# Altium schematic sheet Misc.SchDoc
size A4
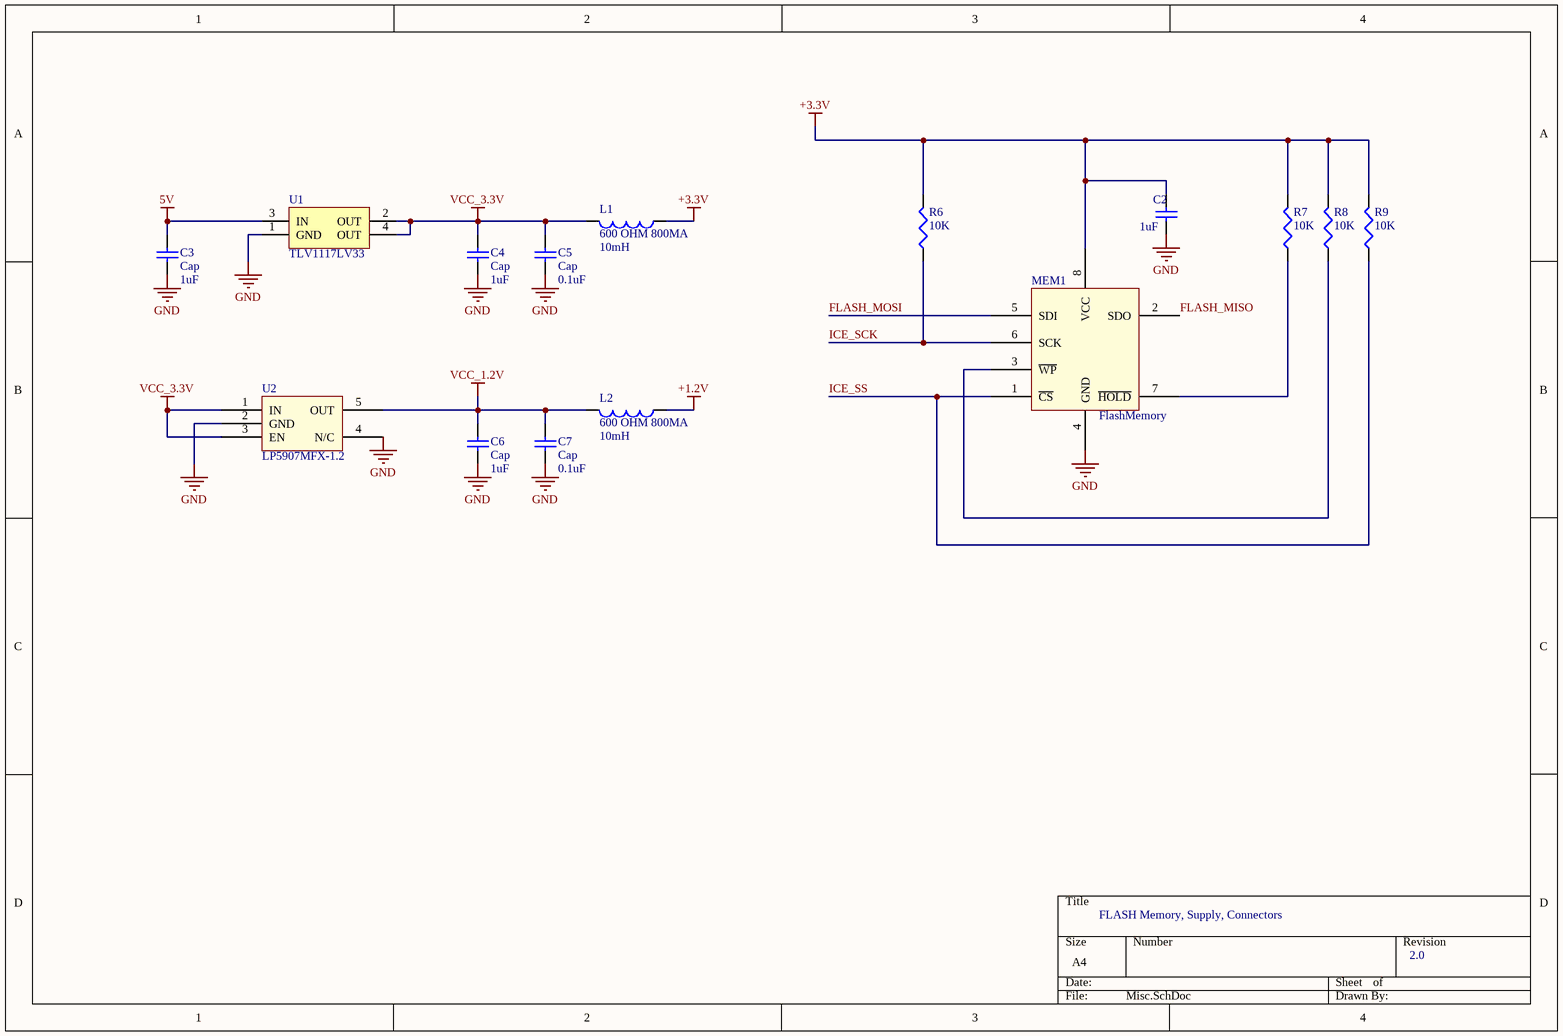
[diagram p0: Misc.SchDoc]

## Parts
C2  value 1uF  [C0402]  (hidden comment: Cap Semi)
C3  Cap  value 1uF  [C0603]
C4  Cap  value 1uF  [C0603]
C5  Cap  value 0.1uF  [C0402]
C6  Cap  value 1uF  [C0402]
C7  Cap  value 0.1uF  [C0402]
L1  600 OHM 800MA  value 10mH  [J1-0603]
L2  600 OHM 800MA  value 10mH  [J1-0603]
MEM1  FlashMemory  [SOP8FlashCorrect]
R6  value 10K  [R0402]  (hidden comment: Res3)
R7  value 10K  [R0402]  (hidden comment: Res3)
R8  value 10K  [R0402]  (hidden comment: Res3)
R9  value 10K  [R0402]  (hidden comment: Res3)
U1  TLV1117LV33  [ZZ311]
U2  LP5907MFX-1.2  [1-2Regulator]

## Nets
5V: C3.2 U1.3(IN)
+1.2V: L2.1
+3.3V: C2.2 L1.1 MEM1.8(VCC) R6.2 R7.2 R8.2 R9.2
GND: C2.1 C3.1 C4.1 C5.1 C6.1 C7.1 MEM1.4(GND) U1.1(GND) U2.2(GND) U2.4(N/C)
VCC_1.2V: C6.2 C7.2 L2.2 U2.5(OUT)
VCC_3.3V: C4.2 C5.2 L1.2 U1.2(OUT) U1.4(OUT) U2.1(IN) U2.3(EN)
FLASH_MISO: MEM1.2(SDO)
FLASH_MOSI: MEM1.5(SDI)
ICE_SCK: MEM1.6(SCK) R6.1
ICE_SS: MEM1.1(~{CS}) R9.1
NetMEM1_3: MEM1.3(~{WP}) R8.1
NetMEM1_7: MEM1.7(~{HOLD}) R7.1

## Notes on the sheet
- FLASH Memory, Supply, Connectors
- 2.0

## Library data of the parts
C2 C6 = Cap Semi: Capacitor (Semiconductor SIM Model); Manufacturer: TDK Corporation; Manufacturer Part Number: CGB2A1JB1E105M033BC; Tolerance: ±20%; Voltage - Rated: 25V; Temperature Coefficient: JB; Notification: Current market demand for these product types have resulted in fluctuating and extending lead times. Lead times may differ.; Published: 8-Jun-2000; LatestRevisionDate: 29-May-2009; LatestRevisionNote: IPC-7351 Footprint Added.; PackageReference: C1206; Publisher: Altium Limited; PackageDescription: Chip Capacitor; Supplier 1: Digi-Key; Supplier Part Number 1: 445-12016-1-ND; RoHS: RoHS Compliant; Category: Capacitors; Stock 1: 0; Pricing 1: 1=0.25, 10=0.173, 100=0.0874, 500=0.0598, 1000=0.0529, 2500=0.0506, 5000=0.046 (USD); Packaging: Cut Tape (CT); Part Status: Active; Operating Temperature: -25°C ~ 85°C; Features: Low Profile; Ratings: -; Applications: General Purpose; Failure Rate: -; Mounting Type: Surface Mount, MLCC; Package / Case: 0402 (1005 Metric); Size / Dimension: 0.039" L x 0.020" W (1.00mm x 0.50mm); Height - Seated (Max): -; Thickness (Max): 0.013" (0.33mm); Lead Spacing: -; Lead Style: -; ComponentLink1URL: https://product.tdk.com/info/en/catalog/datasheets/mlcc_commercial_lowprofile_en.pdf; ComponentLink1Description: https://product.tdk.com/info/en/catalog/datasheets/mlcc_commercial_lowprofile_en.pdf
C3 C4 = Cap Semi: Capacitor (Semiconductor SIM Model); Manufacturer: Yageo; Manufacturer Part Number: CC0603KRX5R8BB105; Tolerance: ±10%; Voltage - Rated: 25V; Temperature Coefficient: X5R; Notification: Current market demand for these product types have resulted in fluctuating and extending lead times. Lead times may differ.; Published: 8-Jun-2000; LatestRevisionDate: 29-May-2009; LatestRevisionNote: IPC-7351 Footprint Added.; PackageReference: C1206; Publisher: Altium Limited; PackageDescription: Chip Capacitor; Supplier 1: Digi-Key; Supplier Part Number 1: 311-1445-1-ND; RoHS: RoHS Compliant; Category: Capacitors; Stock 1: 40000; Pricing 1: 1=0.25, 10=0.179, 100=0.0843, 500=0.05908, 1000=0.04891 (USD); Packaging: Cut Tape (CT); Part Status: Active; Operating Temperature: -55°C ~ 85°C; Features: -; Ratings: -; Applications: General Purpose; Failure Rate: -; Mounting Type: Surface Mount, MLCC; Package / Case: 0603 (1608 Metric); Size / Dimension: 0.063" L x 0.031" W (1.60mm x 0.80mm); Height - Seated (Max): -; Thickness (Max): 0.035" (0.90mm); Lead Spacing: -; Lead Style: -; ComponentLink1URL: http://www.yageo.com/documents/recent/UPY-GPHC_X5R_4V-to-50V_25.pdf; ComponentLink1Description: http://www.yageo.com/documents/recent/UPY-GPHC_X5R_4V-to-50V_25.pdf
C5 C7 = Cap Semi: Capacitor (Semiconductor SIM Model); Manufacturer: Samsung Electro-Mechanics; Manufacturer Part Number: CL05B104KA5NNNC; Tolerance: ±10%; Voltage - Rated: 25V; Temperature Coefficient: X7R; Notification: Current market demand for these product types have resulted in fluctuating and extending lead times. Lead times may differ.; Published: 8-Jun-2000; LatestRevisionDate: 29-May-2009; LatestRevisionNote: IPC-7351 Footprint Added.; PackageReference: C1206; Publisher: Altium Limited; PackageDescription: Chip Capacitor; Supplier 1: Digi-Key; Supplier Part Number 1: 1276-6720-1-ND; RoHS: RoHS Compliant; Category: Capacitors; Stock 1: 0; Pricing 1: 1=0.1, 10=0.071, 100=0.0317, 500=0.02262, 1000=0.01777, 2500=0.01616, 5000=0.01486 (USD); Packaging: Cut Tape (CT); Part Status: Active; Operating Temperature: -55°C ~ 125°C; Features: -; Ratings: -; Applications: General Purpose; Mounting Type: Surface Mount, MLCC; Package / Case: 0402 (1005 Metric); Size / Dimension: 0.039" L x 0.020" W (1.00mm x 0.50mm); Height - Seated (Max): -; Thickness (Max): 0.022" (0.55mm); Lead Spacing: -; Lead Style: -; ComponentLink1URL: http://www.samsungsem.com/kr/support/product-search/mlcc/CL05B104KA5NNNC.jsp; ComponentLink1Description: http://www.samsungsem.com/kr/support/product-search/mlcc/CL05B104KA5NNNC.jsp
L1 L2 = Inductor: Manufacturer: Murata Electronics North America; Manufacturer Part Number: BLM18HE601SN1D; Code_IEC: 1005; Filter Type: Signal Line; DC Resistance (DCR) (Max): 250 mOhm; Published: 8-Jun-2000; LatestRevisionDate: 29-May-2009; LatestRevisionNote: IPC-7351 Footprint Added.; PackageReference: 0402-A; Publisher: Altium Limited; PackageDescription: Chip Inductor; Code_JEITA: 0402; Supplier 1: Digi-Key; Supplier Part Number 1: 490-5214-1-ND; RoHS: RoHS Compliant; Category: Filters; Stock 1: 152784; Pricing 1: 1=0.22, 10=0.179, 25=0.1392, 50=0.1154, 100=0.0996, 250=0.07964, 500=0.07168, 1000=0.05973 (USD); Packaging: Cut Tape (CT); Part Status: Active; Current Rating (Max): 800mA; Ratings: -; Operating Temperature: -55°C ~ 125°C; Package / Case: 0603 (1608 Metric); Mounting Type: Surface Mount; Height (Max): 0.037" (0.95mm); Size / Dimension: 0.063" L x 0.032" W (1.60mm x 0.80mm); ComponentLink1URL: https://www.murata.com/en-us/products/productdata/8796741599262/ENFA0004.pdf; ComponentLink1Description: https://www.murata.com/en-us/products/productdata/8796741599262/ENFA0004.pdf
MEM1 = W25Q32JVSSIQ: IC FLASH 32M SPI 133MHZ 8SOIC; Manufacturer: Winbond Electronics; Memory Type: Non-Volatile; Write Cycle Time - Word, Page: 3ms; Voltage - Supply: 2.7 V ~ 3.6 V; Memory Interface: SPI - Quad I/O; Memory Size: 32Mb (4M x 8); Memory Format: FLASH; RoHS: RoHS Compliant; Manufacturer Part Number: W25Q32JVSSIQ; Technology: FLASH - NOR; Part Status: Active; Packaging: Tube; Category: Integrated Circuits (ICs); Supplier Device Package: 8-SOIC; Mounting Type: Surface Mount; Operating Temperature: -40°C ~ 85°C (TA); Package / Case: 8-SOIC (0.209", 5.30mm Width); ComponentLink1URL: http://www.winbond.com/resource-files/w25q32jv%20revg%2003272018%20plus.pdf; ComponentLink1Description: http://www.winbond.com/resource-files/w25q32jv%20revg%2003272018%20plus.pdf; Supplier 1: Digi-Key; Stock 1: 41181; Pricing 1: 1=0.81, 10=0.74, 25=0.7308, 90=0.72667, 180=0.64972, 270=0.64411, 540=0.63474, 810=0.62498, 1080=0.61183 (USD); Supplier Part Number 1: W25Q32JVSSIQ-ND
R6-R9 = Res3: Resistor; Manufacturer: Yageo; Manufacturer Part Number: RC0402JR-0710KP; Tolerance: ±5%; Power (Watts): 0.063W, 1/16W; Temperature Coefficient: ±150ppm/°C; Published: 8-Jun-2000; LatestRevisionDate: 29-May-2009; LatestRevisionNote: IPC-7351 Footprint Added.; PackageReference: J1-0603; Publisher: Altium Limited; PackageDescription: Chip Resistor; Supplier 1: Digi-Key; Supplier Part Number 1: YAG1281CT-ND; RoHS: RoHS Compliant; Category: Resistors; Stock 1: 0; Pricing 1: 1=0.1, 10=0.028, 100=0.0119, 1000=0.00557, 2500=0.0049, 5000=0.00411 (USD); Packaging: Cut Tape (CT); Part Status: Active; Composition: Thick Film; Features: Moisture Resistant; Operating Temperature: -55°C ~ 155°C; Package / Case: 0402 (1005 Metric); Supplier Device Package: 0402; Size / Dimension: 0.039" L x 0.020" W (1.00mm x 0.50mm); Height - Seated (Max): 0.016" (0.40mm); Failure Rate: -; ComponentLink1URL: http://www.yageo.com/NewPortal/yageodocoutput?fileName=/pdf/R-Chip/PYu-RC_51_RoHS_P_0.pdf; ComponentLink1Description: http://www.yageo.com/NewPortal/yageodocoutput?fileName=/pdf/R-Chip/PYu-RC_51_RoHS_P_0.pdf
U1 = TLV1117LV33DCYR: IC REG LINEAR 3.3V 1A SOT223-4; Manufacturer: Texas Instruments; Output Configuration: Positive; Output Type: Fixed; Voltage - Input (Max): 5.5V; Voltage Dropout (Max): 1.3V @ 800mA; PSRR: 75dB (120Hz); Protection Features: Over Current, Over Temperature; ComponentLink1Description: http://www.ti.com/lit/ds/symlink/tlv1117lv.pdf; ComponentLink1URL: http://www.ti.com/lit/ds/symlink/tlv1117lv.pdf; Supplier 1: Digi-Key; Manufacturer Part Number: TLV1117LV33DCYR; RoHS: RoHS Compliant; Category: Integrated Circuits (ICs); Stock 1: 20855; Packaging: Cut Tape (CT); Part Status: Active; Voltage - Output (Min/Fixed): 3.3V; Voltage - Output (Max): -; Current - Output: 1A; Control Features: -; Operating Temperature: -40°C ~ 125°C; Mounting Type: Surface Mount; Package / Case: TO-261-4, TO-261AA; Supplier Device Package: SOT-223-4; Base Part Number: TLV1117LV33; Supplier Part Number 1: 296-28778-1-ND; Pricing 1: 1=0.68, 10=0.598, 100=0.4586, 500=0.36256, 1000=0.29005 (USD)
U2 = LP5907MFX-1.2/NOPB: IC REG LINEAR 1.2V 250MA SOT23-5; Manufacturer: Texas Instruments; Output Configuration: Positive; Output Type: Fixed; Voltage - Input (Max): 5.5V; Voltage Dropout (Max): 0.25V @ 250mA; PSRR: 90dB ~ 60dB (100Hz ~ 100kHz); Control Features: Enable; Protection Features: Over Temperature, Short Circuit; Supplier 1: Digi-Key; Manufacturer Part Number: LP5907MFX-1.2/NOPB; RoHS: RoHS Compliant; Category: Integrated Circuits (ICs); Stock 1: 65117; Packaging: Cut Tape (CT); Part Status: Active; Voltage - Output (Min/Fixed): 1.2V; Voltage - Output (Max): -; Current - Output: 250mA; Operating Temperature: -40°C ~ 125°C; Mounting Type: Surface Mount; Package / Case: SC-74A, SOT-753; Supplier Device Package: SOT-23-5; ComponentLink1URL: http://www.ti.com/lit/ds/symlink/lp5907.pdf; ComponentLink1Description: http://www.ti.com/lit/ds/symlink/lp5907.pdf; Supplier Part Number 1: 296-39062-1-ND; Pricing 1: 1=0.55, 10=0.475, 100=0.3547, 500=0.27872, 1000=0.21537 (USD)